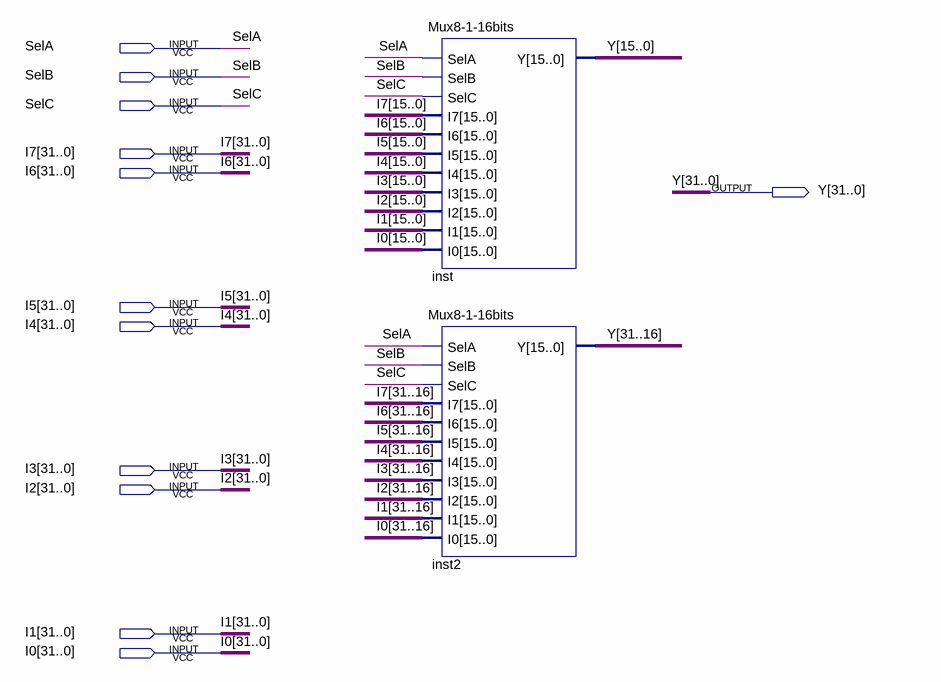
[diagram p0: schematic sheet]
// Quartus schematic Mux8-1-32bits.bdf as structural Verilog: 2 symbols, 12 pins
module \Mux8-1-32bits  (
  input  SelA,
  input  SelB,
  input  SelC,
  input  [31:0] I7,
  input  [31:0] I6,
  input  [31:0] I5,
  input  [31:0] I4,
  input  [31:0] I3,
  input  [31:0] I2,
  input  [31:0] I1,
  input  [31:0] I0,
  output [31:0] Y
);

  \Mux8-1-16bits  inst (
    .SelA(SelA), .SelB(SelB), .SelC(SelC), .I7(I7[15:0]), .I6(I6[15:0]), .I5(I5[15:0]), .I4(I4[15:0]),
    .I3(I3[15:0]), .I2(I2[15:0]), .I1(I1[15:0]), .I0(I0[15:0]), .Y(Y[15:0]));
  \Mux8-1-16bits  inst2 (
    .SelA(SelA), .SelB(SelB), .SelC(SelC), .I7(I7[31:16]), .I6(I6[31:16]), .I5(I5[31:16]), .I4(I4[31:16]),
    .I3(I3[31:16]), .I2(I2[31:16]), .I1(I1[31:16]), .I0(I0[31:16]), .Y(Y[31:16]));
endmodule
